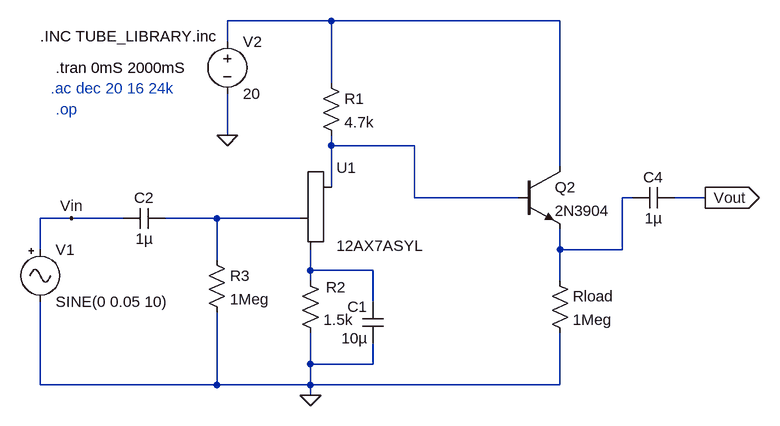
[diagram p0: schematic Headphone_amp.asc]
Headphone_amp.asc, the LTspice schematic file:
Version 4
SHEET 1 880 680
WIRE 160 -16 0 -16
WIRE 512 -16 160 -16
WIRE 0 16 0 -16
WIRE 160 80 160 -16
WIRE 0 160 0 96
WIRE 160 176 160 160
WIRE 288 176 160 176
WIRE 512 208 512 -16
WIRE 160 240 160 176
WIRE 288 256 288 176
WIRE 448 256 288 256
WIRE 624 256 608 256
WIRE 736 256 688 256
WIRE -240 288 -288 288
WIRE -160 288 -240 288
WIRE -16 288 -96 288
WIRE 112 288 -16 288
WIRE -288 336 -288 288
WIRE 512 336 512 304
WIRE 608 336 608 256
WIRE 608 336 512 336
WIRE -16 352 -16 288
WIRE 128 368 128 336
WIRE 224 368 128 368
WIRE 128 384 128 368
WIRE 512 384 512 336
WIRE 224 416 224 368
WIRE 128 512 128 464
WIRE 224 512 224 480
WIRE 224 512 128 512
WIRE -288 544 -288 416
WIRE -16 544 -16 432
WIRE -16 544 -288 544
WIRE 128 544 128 512
WIRE 128 544 -16 544
WIRE 512 544 512 464
WIRE 512 544 128 544
WIRE 128 560 128 544
FLAG 128 560 0
FLAG 0 160 0
FLAG -240 288 Vin
FLAG 736 256 Vout
IOPIN 736 256 Out
SYMBOL triode 160 288 R0
SYMATTR InstName U1
SYMATTR Value 12AX7ASYL
SYMBOL Misc/signal -288 320 R0
SYMATTR InstName V1
SYMATTR Value SINE(0 0.05 10)
SYMATTR Value2 AC 1
SYMBOL voltage 0 0 R0
SYMATTR InstName V2
SYMATTR Value 20
SYMBOL res 144 64 R0
SYMATTR InstName R1
SYMATTR Value 4.7k
SYMBOL res 112 368 R0
WINDOW 0 40 26 Left 2
SYMATTR InstName R2
SYMATTR Value 1.5k
SYMBOL res -32 336 R0
SYMATTR InstName R3
SYMATTR Value 1Meg
SYMBOL res 496 368 R0
SYMATTR InstName Rload
SYMATTR Value 1Meg
SYMBOL cap -96 272 R90
WINDOW 0 0 32 VBottom 2
WINDOW 3 32 32 VTop 2
SYMATTR InstName C2
SYMATTR Value 1µ
SYMBOL cap 240 480 R180
WINDOW 0 24 56 Left 2
WINDOW 3 24 8 Left 2
SYMATTR InstName C1
SYMATTR Value 10µ
SYMBOL npn 448 208 R0
SYMATTR InstName Q2
SYMATTR Value 2N3904
SYMBOL cap 688 240 R90
WINDOW 0 0 32 VBottom 2
WINDOW 3 32 32 VTop 2
SYMATTR InstName C4
SYMATTR Value 1µ
TEXT -264 56 Left 2 !.tran 0mS 2000mS
TEXT -288 8 Left 2 !.INC TUBE_LIBRARY.inc
TEXT -272 88 Left 2 ;.ac dec 20 16 24k
TEXT -264 120 Left 2 ;.op

The netlist it stands for:
* Headphone_amp.asc
XU1 N002 N004 N005 12AX7ASYL
V1 Vin 0 SINE(0 0.05 10) AC 1
V2 N001 0 20
R1 N001 N002 4.7k
R2 N005 0 1.5k
R3 N004 0 1Meg
Rload N003 0 1Meg
C2 N004 Vin 1µ
C1 0 N005 10µ
Q2 N001 N002 N003 0 2N3904
C4 Vout N003 1µ
.model NPN NPN
.model PNP PNP
.lib standard.bjt
.tran 0mS 2000mS
.INC TUBE_LIBRARY.inc
* .ac dec 20 16 24k
* .op
.backanno
.end